# EAGLE design mainboard (EAGLE 8.7.0)
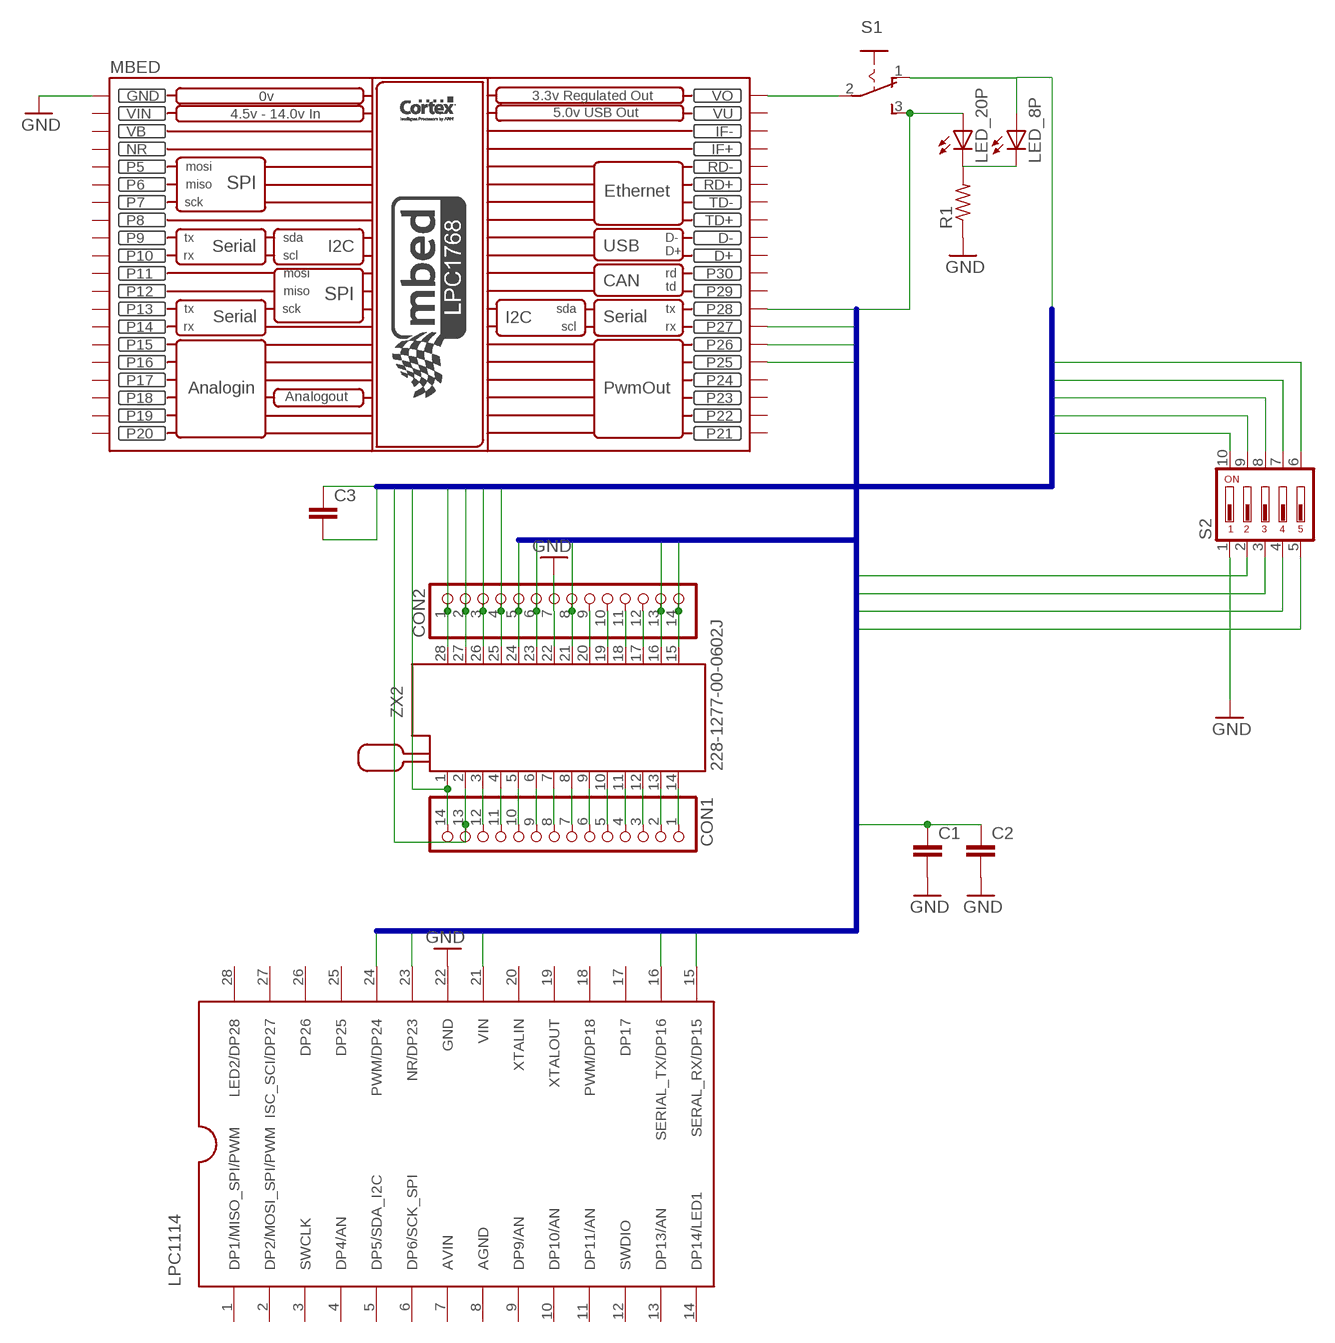
[diagram p0: schematic, sheet 1]

## Parts
C1  C-EUC2012  [C2012]
C2  C-EUC2012  [C2012]
C3  C-EUC2012  [C2012]
CON1  PINHD-1X14  [1X14]
CON2  PINHD-1X14  [1X14]
LED_8P  LED3MM  [LED3MM]
LED_20P  LED3MM  [LED3MM]
LPC1114  LPC1114FDH28  [TSSOP28]
MBED  MBED_NXP_LPC1768  [MBED-KIT]
R1  R-US_0207/10  [0207/10]
S1  M251  [M251]
S2  DIP05YL  [DIP05YL]
ZX2  228-1277-00-0602J  [228-1277-00-0602J]

## Nets
BUS0: C1.1 C2.1 CON2.8 LED_20P.A LPC1114.21(VIN) S1.3(S) ZX2.21
BUS2: CON2.14 LPC1114.15(SERAL_RX/DP15) MBED.P$28(P28) S2.2 ZX2.15
BUS3: CON2.13 LPC1114.16(SERIAL_TX/DP16) MBED.P$27(P27) S2.5 ZX2.16
BUS4: CON2.6 LPC1114.23(NR/DP23) MBED.P$26(P26) S2.4 ZX2.23
BUS5: CON2.5 LPC1114.24(PWM/DP24) MBED.P$25(P25) S2.3 ZX2.24
BUS8P0: C3.1 CON2.3 LED_8P.A S1.1(O) ZX2.26
BUS8P1: C3.2 CON2.2 S2.10 ZX2.27
BUS8P2: CON2.1 S2.9 ZX2.28
BUS8P3: CON1.14 S2.6 ZX2.1
BUS8P4: CON1.13 S2.7 ZX2.2
BUS8P5: CON2.4 S2.8 ZX2.25
GND: C1.2 C2.2 CON2.7 LPC1114.22(GND) MBED.GND R1.1 S2.1 ZX2.22
N$1: MBED.VOUT(VO) S1.2(P)
N$2: LED_8P.K(C) LED_20P.K(C) R1.2
N$3: CON1.1 ZX2.14
N$4: CON1.2 ZX2.13
N$5: CON1.3 ZX2.12
N$6: CON1.4 ZX2.11
N$7: CON1.5 ZX2.10
N$8: CON1.6 ZX2.9
N$9: CON1.7 ZX2.8
N$10: CON1.8 ZX2.7
N$11: CON1.9 ZX2.6
N$12: CON1.10 ZX2.5
N$13: CON1.11 ZX2.4
N$14: CON1.12 ZX2.3
N$22: CON2.9 ZX2.20
N$23: CON2.10 ZX2.19
N$24: CON2.11 ZX2.18
N$25: CON2.12 ZX2.17
Unconnected: LPC1114.1(DP1/MISO_SPI/PWM) LPC1114.2(DP2/MOSI_SPI/PWM) LPC1114.3(SWCLK) LPC1114.4(DP4/AN) LPC1114.5(DP5/SDA_I2C) LPC1114.6(DP6/SCK_SPI) LPC1114.9(DP9/AN) LPC1114.10(DP10/AN) LPC1114.11(DP11/AN) LPC1114.12(SWDIO) LPC1114.13(DP13/AN) LPC1114.14(DP14/LED1) LPC1114.17(DP17) LPC1114.18(PWM/DP18) LPC1114.19(XTALOUT) LPC1114.20(XTALIN) LPC1114.25(DP25) LPC1114.26(DP26) LPC1114.27(ISC_SCI/DP27) LPC1114.28(LED2/DP28) MBED.D+ MBED.D- MBED.IF+ MBED.IF- MBED.P$5(P5) MBED.P$6(P6) MBED.P$7(P7) MBED.P$8(P8) MBED.P$9(P9) MBED.P$10(P10) MBED.P$11(P11) MBED.P$12(P12) MBED.P$13(P13) MBED.P$14(P14) MBED.P$15(P15) MBED.P$16(P16) MBED.P$17(P17) MBED.P$18(P18) MBED.P$19(P19) MBED.P$20(P20) MBED.P$21(P21) MBED.P$22(P22) MBED.P$23(P23) MBED.P$24(P24) MBED.P$29(P29) MBED.P$30(P30) MBED.RD+ MBED.RD- MBED.TD+ MBED.TD-

## Buses
BUS[0..5]
BUS8P[0..5]

## Power pins joined to a net without a drawn wire
AGND: LPC1114.8(AGND)
AVIN: LPC1114.7(AVIN)
NR: MBED.NR
VB: MBED.VB
VIN: MBED.VIN
VU: MBED.VU

## Library data of the parts
C1-C3 = rcl:C-EU: CAPACITOR, European symbol
CON1 CON2 = pinhead:PINHD-1X14: PIN HEADER
LED_8P LED_20P = LED:LED: LED OSRAM: - CHIPLED LG R971, LG N971, LY N971, LG Q971, LY Q971, LO R971, LY R971 LH N974, LH R974 LS Q976, LO Q976, LY Q976 LO Q996 - Hyper CHIPLED LW Q18S LB Q993, LB Q99A, LB R99A - SideLED LS A670, LO A670, LY A670, LG A670, LP A670 LB A673, LV A673, LT A673, LW A673 LH A674 LY A675 LS A676, LA A676, LO A676, LY A676, LW A676 LS A679, LY A679, LG A679 - Hyper Micro SIDELED® LS Y876, LA Y876, LO Y876, LY Y876 LT Y87S - SmartLED LW L88C, LW L88S LB L89C, LB L89S, LG L890 LS L89K, LO L89K, LY L89K LS L896, LA L896, LO L896, LY L896 - TOPLED LS T670, LO T670, LY T670, LG T670, LP T670 LSG T670, LSP T670, LSY T670, LOP T670, LYG T670 LG T671, LOG T671, LSG T671 LB T673, LV T673, LT T673, LW T673 LH T674 LS T676, LA T676, LO T676, LY T676, LB T676, LH T676, LSB T676, LW T676 LB T67C, LV T67C, LT T67C, LS T67K, LO T67K, LY T67K, LW E67C LS E67B, LA E67B, LO E67B, LY E67B, LB E67C, LV E67C, LT E67C LW T67C LS T679, LY T679, LG T679 LS T770, LO T770, LY T770, LG T770, LP T770 LB T773, LV T773, LT T773, LW T773 LH T774 LS E675, LA E675, LY E675, LS T675 LS T776, LA T776, LO T776, LY T776, LB T776 LHGB T686 LT T68C, LB T68C - Hyper Mini TOPLED® LB M676 - Mini TOPLED Santana® LG M470 LS M47K, LO M47K, LY M47K Source: http://www.osram.convergy.de LUXEON: - LUMILED® LXK2-PW12-R00, LXK2-PW12-S00, LXK2-PW14-U00, LXK2-PW14-V00 LXK2-PM12-R00, LXK2-PM12-S00, LXK2-PM14-U00 LXK2-PE12-Q00, LXK2-PE12-R00, LXK2-PE12-S00, LXK2-PE14-T00, LXK2-PE14-U00 LXK2-PB12-K00, LXK2-PB12-L00, LXK2-PB12-M00, LXK2-PB14-N00, LXK2-PB14-P00, LXK2-PB14-Q00 LXK2-PR12-L00, LXK2-PR12-M00, LXK2-PR14-Q00, LXK2-PR14-R00 LXK2-PD12-Q00, LXK2-PD12-R00, LXK2-PD12-S00 LXK2-PH12-R00, LXK2-PH12-S00 LXK2-PL12-P00, LXK2-PL12-Q00, LXK2-PL12-R00 Source: www.luxeon.com KINGBRIGHT: KA-3528ASYC Source: www.kingbright.com
LPC1114 = lpc1114fn28:LPC1114FDH28
MBED = MBED_v2.1:MBED_NXP_LPC1768: Mbed LPC1768 - ARM CORTEX v2.1 * Schematic symbol is now placed in eagles's default raster. *The pads diameter are suitable for routing between mbed pins * mbed pads are 0.8 mm drill diameter. --------------------------------------------- Created by: Mohamed Yousry *Alexandria, Egypt *Email: mohamed.yousry@ieeegoldegypt.org
R1 = rcl:R-US_: RESISTOR, American symbol
S1 = switch:M251: SLIDING SWITCH Mors, distributor Buerklin, 11G702
S2 = switch-dil:DIP05YL: DIL/CODE SWITCH; OC_FARNELL: unknown; OC_NEWARK: unknown
ZX2 = con-3m:228-?00-0602J: Zero Insertion Force Socked Source: http://www.3M.com/ehpd; MF: 3M; MPN: 228-1277-00-0602J; OC_FARNELL: 9897356; OC_NEWARK: 85K7825

## Net classes
0 default: width 0.152 mm, clearance 0.152 mm

## Board
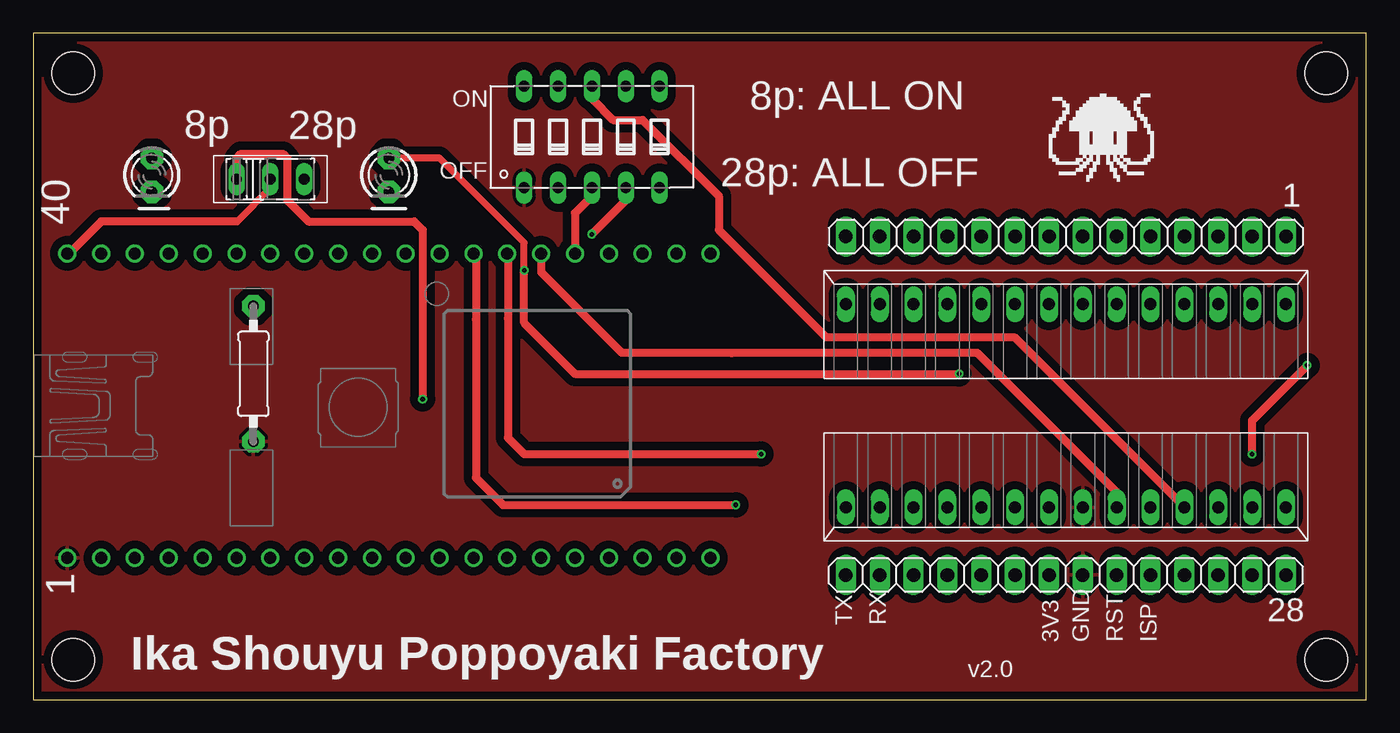
[diagram p1: board, top side]
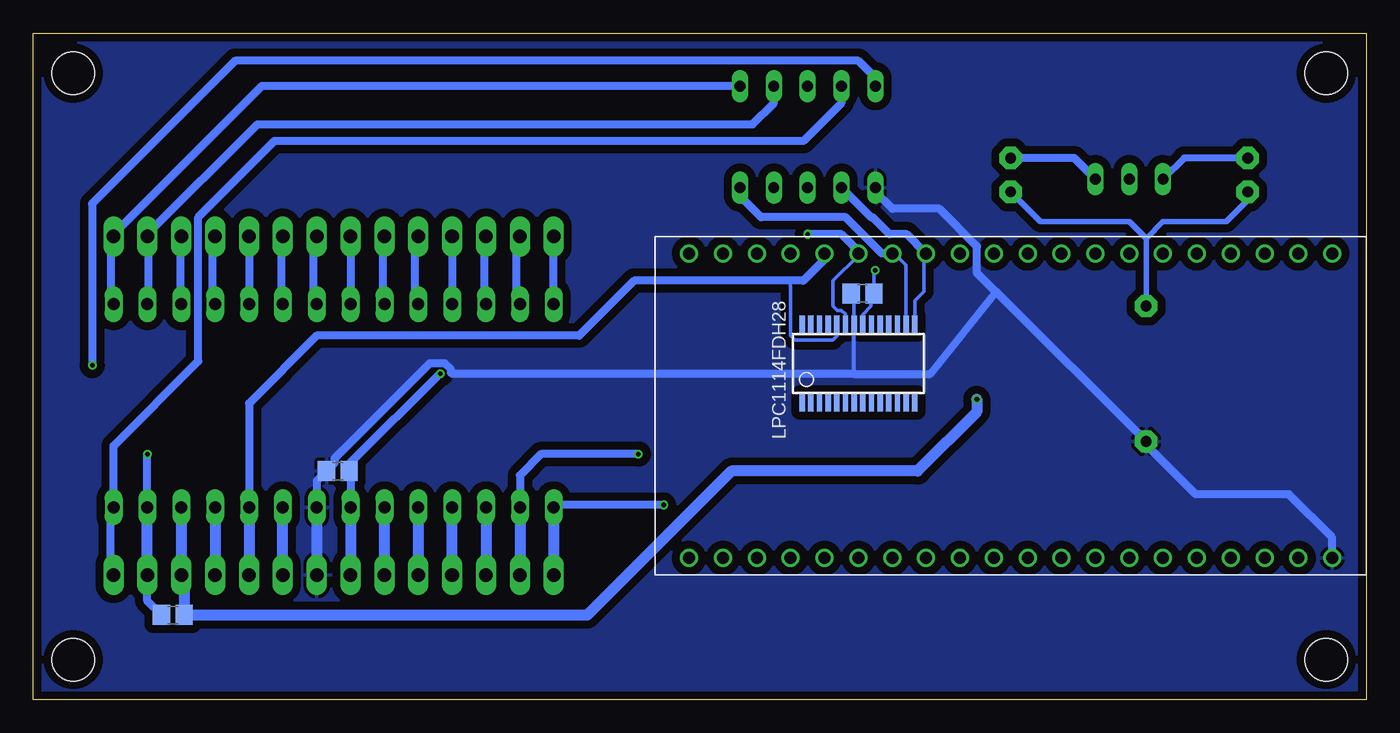
[diagram p2: board, bottom side, seen from below]

Size 100 x 50 mm. Coordinates in mm from the lower left corner, seen from the top.
Outline: 0,0 100,0 100,50 0,50 0,0
Copper layers (1*16): Top 0.035mm / dielectric 1.6mm / Bottom 0.035mm
Design rules "Elecrow_2-layer_PCB_eagle_rule": minimum track width 6mil, minimum drill 12mil, track to track 6mil, track to pad 6mil, pad to pad 6mil, via to via 8mil, smd to smd 0mil, copper to edge 20mil, drill to drill 10mil, minimum pad ring 6mil, minimum via ring 6mil, stop-mask expansion 0mil, vias tented up to drill 100mil, thermal gap 10mil
Holes 3.2 mm at 3,3 3,47 97,3 97,47

### Footprints (pad centres in the part's own frame; a part is rotated, then mirrored left to right if it is on the bottom)
C2012 = smd 1.3 x 1.5: 1 -0.85,0; 2 0.85,0
1X14 = drill 1.016 long: 1 -16.51,0; 2 -13.97,0; 3 -11.43,0; 4 -8.89,0; 5 -6.35,0; 6 -3.81,0; 7 -1.27,0; 8 1.27,0; 9 3.81,0; 10 6.35,0; 11 8.89,0; 12 11.43,0; 13 13.97,0; 14 16.51,0
LED3MM = drill 0.813 pad 1.676 octagon: A -1.27,0; K 1.27,0
TSSOP28 = smd 0.4 x 1.35: 1 -4.225,-2.925; 2 -3.575,-2.925; 3 -2.925,-2.925; 4 -2.275,-2.925; 5 -1.625,-2.925; 6 -0.975,-2.925; 7 -0.325,-2.925; 8 0.325,-2.925; 9 0.975,-2.925; 10 1.625,-2.925; 11 2.275,-2.925; 12 2.925,-2.925; 13 3.575,-2.925; 14 4.225,-2.925; 15 4.225,2.925; 16 3.575,2.925; 17 2.925,2.925; 18 2.275,2.925; 19 1.625,2.925; 20 0.975,2.925; 21 0.325,2.925; 22 -0.325,2.925; 23 -0.975,2.925; 24 -1.625,2.925; 25 -2.275,2.925; 26 -2.925,2.925; 27 -3.575,2.925; 28 -4.225,2.925
MBED-KIT = drill 0.9: D+ 11.43,1.27; D- 11.43,3.81; GND -11.43,24.13; IF+ 11.43,16.51; IF- 11.43,19.05; NR -11.43,16.51; P$5 -11.43,13.97; P$6 -11.43,11.43; P$7 -11.43,8.89; P$8 -11.43,6.35; P$9 -11.43,3.81; P$10 -11.43,1.27; P$11 -11.43,-1.27; P$12 -11.43,-3.81; P$13 -11.43,-6.35; P$14 -11.43,-8.89; P$15 -11.43,-11.43; P$16 -11.43,-13.97; P$17 -11.43,-16.51; P$18 -11.43,-19.05; P$19 -11.43,-21.59; P$20 -11.43,-24.13; P$21 11.43,-24.13; P$22 11.43,-21.59; P$23 11.43,-19.05; P$24 11.43,-16.51; P$25 11.43,-13.97; P$26 11.43,-11.43; P$27 11.43,-8.89; P$28 11.43,-6.35; P$29 11.43,-3.81; P$30 11.43,-1.27; RD+ 11.43,11.43; RD- 11.43,13.97; TD+ 11.43,6.35; TD- 11.43,8.89; VB -11.43,19.05; VIN -11.43,21.59; VOUT 11.43,24.13; VU 11.43,21.59
0207/10 = drill 0.813 pad 1.676 octagon: 1 -5.08,0; 2 5.08,0
M251 = drill 0.813 long: 1 -2.54,0; 2 0,0; 3 2.54,0
DIP05YL = drill 0.813 long: 1 -5.08,-3.81; 2 -2.54,-3.81; 3 0,-3.81; 4 2.54,-3.81; 5 5.08,-3.81; 6 5.08,3.81; 7 2.54,3.81; 8 0,3.81; 9 -2.54,3.81; 10 -5.08,3.81
228-1277-00-0602J = drill 0.9 long: 1 -16.51,-7.62; 2 -13.97,-7.62; 3 -11.43,-7.62; 4 -8.89,-7.62; 5 -6.35,-7.62; 6 -3.81,-7.62; 7 -1.27,-7.62; 8 1.27,-7.62; 9 3.81,-7.62; 10 6.35,-7.62; 11 8.89,-7.62; 12 11.43,-7.62; 13 13.97,-7.62; 14 16.51,-7.62; 15 16.51,7.62; 16 13.97,7.62; 17 11.43,7.62; 18 8.89,7.62; 19 6.35,7.62; 20 3.81,7.62; 21 1.27,7.62; 22 -1.27,7.62; 23 -3.81,7.62; 24 -6.35,7.62; 25 -8.89,7.62; 26 -11.43,7.62; 27 -13.97,7.62; 28 -16.51,7.62

### Placement (x,y rotation side)
C1  37.78,30.48 180 bottom
C2  77.15,17.14 180 bottom
C3  89.53,6.35 180 bottom
CON1  77.47,34.75 0 top
CON2  77.47,9.35 180 top
LED_8P  8.89,39.37 270 top
LED_20P  26.67,39.37 270 top
LPC1114  38.1,25.23 0 bottom
MBED  26.67,22.05 90 top
R1  16.51,24.45 90 top
S1  17.78,39.05 0 top
S2  41.91,42.23 0 top
ZX2  77.47,22.05 180 top

### Tracks (layer width: path | path; a pad name or v marks a point on that pad's centre or on a via)
BUS0  (via drill 0.35)
  Top 0.508: v36.83,32.21 36.83,34.29 30.48,40.64 LED_20P.A
  Top 0.61: v36.83,32.21 36.83,28.26 40.64,24.45 v69.46,24.45
  Bottom 0.254: LPC1114.21 37.77,28.9 37.15,29.53 37.15,30.27 C1.1 36.93,32.11 v36.83,32.21
  Bottom 0.61: LED_20P.A 21.91,40.64 S1.3 | v69.46,24.45 69.53,24.45 76.2,17.78 76.2,17.25 C2.1 76.2,17.04 ZX2.21
  Bottom 0.813: ZX2.21 CON2.8
BUS2  (via drill 0.35)
  Top 0.6: 33.2,28.53 33.2,33.4 MBED.P$28
  Top 0.61: 33.2,28.53 33.2,16.65 35.24,14.61 v52.7,14.61
  Bottom 0.254: LPC1114.15 33.88,29.94 33.2,30.62 33.2,33.6
  Bottom 0.6: 33.2,33.6 MBED.P$28
  Bottom 0.61: v52.7,14.61 60.78,14.61 ZX2.15 | MBED.P$28 34.47,34.92 35.76,34.92 37.03,36.2 37.15,36.2 S2.2
  Bottom 0.813: ZX2.15 CON2.14
BUS3  (via drill 0.35)
  Top 0.6: 35.6,28.6 35.6,33.4 MBED.P$27
  Top 0.61: 35.6,28.6 35.6,19.64 36.83,18.41 v54.61,18.41
  Bottom 0.254: LPC1114.16 34.52,32.62 35.56,33.66
  Bottom 0.406: LPC1114.16 34.52,27.76
  Bottom 0.6: 35.56,33.66 MBED.P$27
  Bottom 0.61: v54.61,18.41 61.91,18.41 63.5,16.83 ZX2.16 | S2.5 46.99,37.78 45.4,36.2 39.05,36.2 36.34,33.48 MBED.P$27
  Bottom 0.813: ZX2.16 CON2.13
BUS4  (via drill 0.35)
  Top 0.6: 80.99,14.6 ZX2.23 | 52.4,26 52.4,26.04
  Top 0.61: ZX2.23 81.28,15.56 70.8,26.04 52.4,26.04 44.13,26.04 38.1,32.07 MBED.P$26 | S2.4 44.45,37.47 v41.91,34.92
  Bottom 0.254: MBED.P$26 38.1,33.34 40.01,31.43 40.01,29.53 39.69,29.21 39.37,29.21 39.08,28.91 LPC1114.23
  Bottom 0.6: 39.37,34.92 38.1,33.66 MBED.P$26
  Bottom 0.61: 39.37,34.92 v41.91,34.92
  Bottom 0.813: CON2.6 ZX2.23
BUS5
  Top 0.6: 40.8,33.2 MBED.P$25 40.8,33.6
  Top 0.61: S2.3 41.91,37.78 40.64,36.51 MBED.P$25
  Bottom 0.254: LPC1114.24 39.73,27.27 40.01,26.99 42.86,26.99 43.18,27.3 43.18,31.43
  Bottom 0.406: MBED.P$25 40.64,33.02
  Bottom 0.6: 83.79,14.6 83.8,14.52 ZX2.24 | MBED.P$25 40.8,33.2 40.64,33.02
  Bottom 0.61: 40.64,33.02 42.23,31.43 43.18,31.43 54.93,31.43 59.05,27.3 78.74,27.3 83.82,22.23 83.82,14.54 83.8,14.52
  Bottom 0.813: ZX2.24 CON2.5
BUS8P0  (via drill 0.35)
  Top 0.61: v29.21,22.54 29.21,35.24 28.57,35.88 20.64,35.88 19.05,37.47 19.05,40.64 18.73,40.96 15.56,40.96 15.24,40.64 S1.1
  Bottom 0.508: S1.1 13.65,40.64 LED_8P.A
  Bottom 0.61: CON2.3 88.69,9.13
  Bottom 0.813: ZX2.26 CON2.3 | v29.21,22.54 29.21,21.59 33.66,17.14 47.62,17.14 58.42,6.35 C3.1 88.69,9.13
BUS8P1  (via drill 0.35)
  Top 0.61: v91.44,18.41 91.44,20.95 v95.57,25.08
  Bottom 0.61: ZX2.27 v91.44,18.41 | v95.57,25.08 95.6,25.11 95.6,37.2 84.86,47.94 38.1,47.94 36.83,46.67 S2.10 | C3.2 91.44,7.41 CON2.2
  Bottom 0.813: CON2.2 ZX2.27
BUS8P2
  Bottom 0.6: 94.19,8.2 CON2.1 94.19,9.4 94.19,14.2 ZX2.28 93.98,14.61 | 42.23,41.91 81.92,41.91 87.63,36.2
  Bottom 0.61: ZX2.28 93.98,19.05 87.63,25.4 87.63,36.2 | S2.9 39.37,44.77 42.23,41.91
BUS8P3
  Bottom 0.6: ZX2.1 94.19,29.8 94.19,34.6 CON1.14 93.98,34.92 84.45,44.45
  Bottom 0.61: S2.6 82.87,46.04 84.45,44.45
BUS8P4
  Bottom 0.6: ZX2.2 91.39,29.8 91.39,34.6 CON1.13 91.44,34.92 83.19,43.18
  Bottom 0.61: 83.19,43.18 46.04,43.18 44.45,44.77 S2.7
BUS8P5
  Top 0.6: 60.8,27.2 73.6,27.2 86,14.8 ZX2.25
  Top 0.61: 60.8,27.2 59.48,27.2 51.44,35.24 51.44,37.78 45.72,43.5 43.5,43.5 41.91,45.09 S2.8
  Bottom 0.813: ZX2.25 CON2.4
GND
  Bottom 0.254: LPC1114.22 38.42,30.27 C1.2
  Bottom 0.305: LPC1114.22 38.42,24.68 38.42,24.45
  Bottom 0.6: 29.2,34 29.2,32 27.8,30.6 32.7,24.45 38.42,24.45 68.58,24.45 | 78.4,14.8 ZX2.22
  Bottom 0.61: MBED.GND 2.6,10.68 2.6,12.2 5.8,15.4 12.8,15.4 16.51,19.11 R1.1 27.74,30.6 27.8,30.6 | ZX2.22 78.74,16.41 78.21,16.93 C2.2 77.41,17.74 77.41,18.08 70.26,25.23 69.13,25.23 68.67,24.77 68.67,24.54 68.58,24.45 | 29.2,34 32.03,36.83 35.56,36.83 36.83,38.1 S2.1
  Bottom 0.813: ZX2.22 CON2.7
  pour Bottom (isolate 0.61): -0.64,50.16 -0.64,-0.32 100.65,-0.32 100.65,50.16 100.01,50.16
  pour Top (isolate 0.61): 0,49.85 0,0 100.01,0 100.01,49.85 3.49,49.85
N$1
  Top 0.508: S1.2 17.78,38.38 15.28,35.88
  Top 0.6: 15.28,35.88 5.08,35.88 2.8,33.6 MBED.VOUT
N$2
  Bottom 0.406: 16.51,34.61 17.78,35.88 24.45,35.88 LED_20P.K | 16.51,34.61 15.24,35.88 10.48,35.88 8.89,37.47 LED_8P.K | 16.51,34.61 R1.2
N$3
  Bottom 0.6: ZX2.14 60.99,29.8 60.99,34.6 CON1.1
N$4
  Bottom 0.6: ZX2.13 63.79,29.8 63.79,34.6 CON1.2
N$5
  Bottom 0.6: ZX2.12 66.19,29.8 66.19,34.6 CON1.3
N$6
  Bottom 0.6: ZX2.11 68.59,29.8 68.59,34.6 CON1.4
N$7
  Bottom 0.6: ZX2.10 71.39,29.8 71.39,34.6 CON1.5
N$8
  Bottom 0.6: ZX2.9 73.79,29.8 73.79,34.6 CON1.6
N$9
  Bottom 0.6: ZX2.8 76.19,29.8 76.19,34.6 CON1.7
N$10
  Bottom 0.6: ZX2.7 78.99,29.8 78.99,34.6 CON1.8
N$11
  Bottom 0.6: ZX2.6 81.39,29.8 81.39,34.6 CON1.9
N$12
  Bottom 0.6: ZX2.5 83.79,29.8 83.79,34.6 CON1.10
N$13
  Bottom 0.6: ZX2.4 86.59,29.8 86.59,34.6 CON1.11
N$14
  Bottom 0.6: ZX2.3 88.99,29.8 88.99,34.6 CON1.12
N$15
  cutout Bottom: 36.2,31.43 36.2,29.53 39.69,29.53 39.69,31.11 39.05,31.75
N$22
  Bottom 0.813: CON2.9 ZX2.20
N$23
  Bottom 0.813: ZX2.19 CON2.10
N$24
  Bottom 0.813: CON2.11 ZX2.18
N$25
  Bottom 0.813: ZX2.17 CON2.12

### Text on the board
tPlace: ON | OFF | Ika Shouyu Poppoyaki Factory | v2.0
tNames: 8p: ALL ON | 8p | 28p | 28p: ALL OFF | 1 | 40 | 1 | TX | RX | 28 | 3V3 | GND | RST | ISP